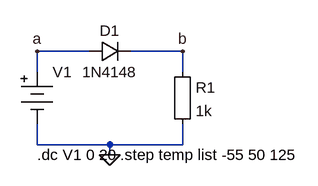
[diagram p0: schematic sch1.asc]
sch1.asc, the LTspice schematic file:
Version 4
SHEET 1 880 680
WIRE 16 208 -64 208
WIRE 160 208 80 208
WIRE -64 240 -64 208
WIRE 160 240 160 208
WIRE -64 352 -64 320
WIRE 48 352 -64 352
WIRE 160 352 160 320
WIRE 160 352 48 352
WIRE 48 368 48 352
FLAG -64 208 a
FLAG 160 208 b
FLAG 48 368 0
SYMBOL diode 16 224 R270
WINDOW 0 32 32 VTop 2
WINDOW 3 0 32 VBottom 2
SYMATTR InstName D1
SYMATTR Value 1N4148
SYMBOL Misc\\EuropeanResistor 144 224 R0
SYMATTR InstName R1
SYMATTR Value 1k
SYMBOL Misc\\battery -64 224 R0
WINDOW 123 0 0 Left 2
WINDOW 39 0 0 Left 2
SYMATTR InstName V1
SYMATTR Value ""
TEXT -64 368 Left 2 !.dc V1 0 20
TEXT 64 368 Left 2 !.step temp list -55 50 125

The netlist it stands for:
* sch1.asc
D1 a b 1N4148
R1 b 0 1k
V1 a 0
.model D D
.lib standard.dio
.dc V1 0 20
.step temp list -55 50 125
.backanno
.end